# EAGLE design mult (EAGLE 6.6.0)
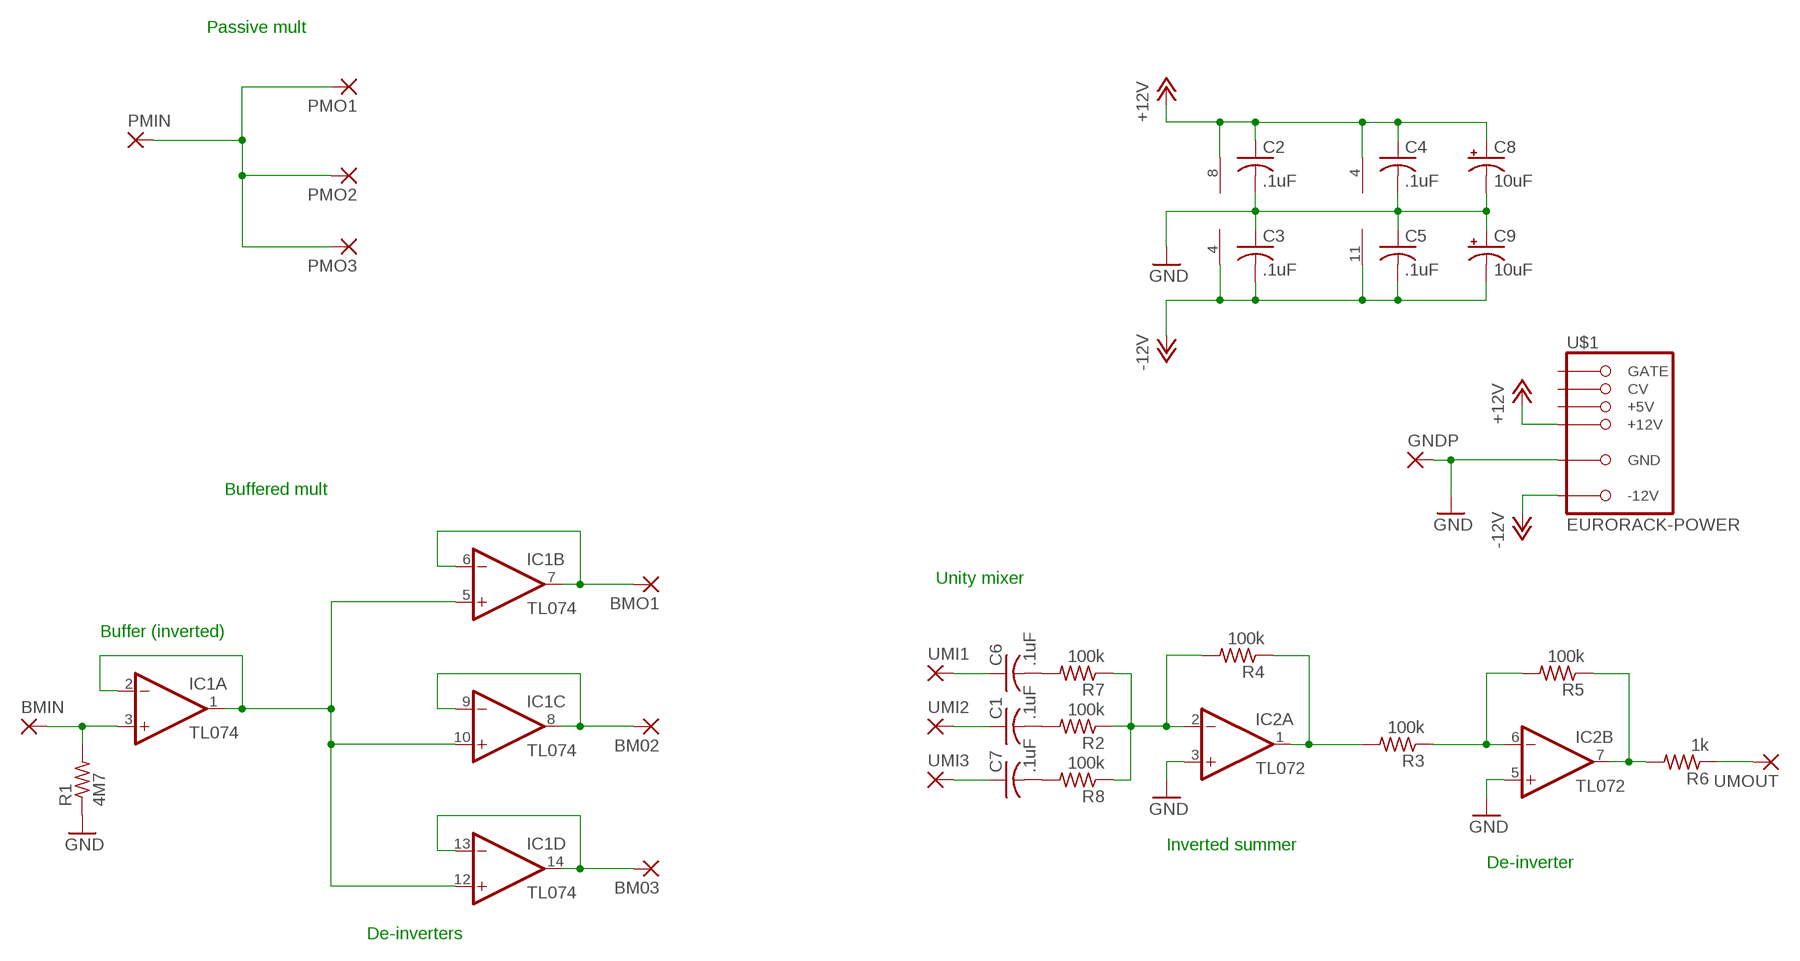
[diagram p0: schematic, sheet 1]

## Parts
BM02  2,54/1,0  [2,54/1,0]
BM03  2,54/1,0  [2,54/1,0]
BMIN  2,54/1,0  [2,54/1,0]
BMO1  2,54/1,0  [2,54/1,0]
C1  .1uF  C-US050-025X075  [C050-025X075]
C2  .1uF  C-US050-025X075  [C050-025X075]
C3  .1uF  C-US050-025X075  [C050-025X075]
C4  .1uF  C-US050-025X075  [C050-025X075]
C5  .1uF  C-US050-025X075  [C050-025X075]
C6  .1uF  C-US050-025X075  [C050-025X075]
C7  .1uF  C-US050-025X075  [C050-025X075]
C8  10uF  CPOL-USE2.5-5  [E2,5-5]
C9  10uF  CPOL-USE2.5-5  [E2,5-5]
GNDP  2,54/1,0  [2,54/1,0]
IC1  TL074  TL074-TOPP  [DIL14]
IC2  TL072  TL072-TOPP  [DIL08]
PMIN  2,54/1,0  [2,54/1,0]
PMO1  2,54/1,0  [2,54/1,0]
PMO2  2,54/1,0  [2,54/1,0]
PMO3  2,54/1,0  [2,54/1,0]
R1  4M7  R-US_0207/10  [0207/10]
R2  100k  R-US_0207/10  [0207/10]
R3  100k  R-US_0207/10  [0207/10]
R4  100k  R-US_0207/10  [0207/10]
R5  100k  R-US_0207/10  [0207/10]
R6  1k  R-US_0207/10  [0207/10]
R7  100k  R-US_0207/10  [0207/10]
R8  100k  R-US_0207/10  [0207/10]
U$1  EURORACK-POWER  [PINSHRD_PTH_2X8]
UMI1  2,54/1,0  [2,54/1,0]
UMI2  2,54/1,0  [2,54/1,0]
UMI3  2,54/1,0  [2,54/1,0]
UMOUT  2,54/1,0  [2,54/1,0]

## Nets
+12V: C2.1 C4.1 C8.+ IC1.4(P:V+) IC2.8(P:V+) U$1.+12V@1(+12V) U$1.+12V@2(+12V)
-12V: C3.2 C5.2 C9.- IC1.11(P:V-) IC2.4(P:V-) U$1.-12V@1(-12V) U$1.-12V@2(-12V)
GND: C2.2 C3.1 C4.2 C5.1 C8.- C9.+ GNDP.1(P) IC2.3(A:+IN) IC2.5(B:+IN) R1.1 U$1.GND@1(GND) U$1.GND@2(GND) U$1.GND@3(GND) U$1.GND@4(GND) U$1.GND@5(GND) U$1.GND@6(GND)
N$1: IC2.7(B:OUT) R5.1 R6.2
N$2: IC2.2(A:-IN) R2.1 R4.2 R7.1 R8.1
N$3: IC2.1(A:OUT) R3.2 R4.1
N$4: IC2.6(B:-IN) R3.1 R5.2
N$5: C1.2 R2.2
N$6: R6.1 UMOUT.1(P)
N$7: C6.1 UMI1.1(P)
N$8: C6.2 R7.2
N$9: C1.1 UMI2.1(P)
N$10: C7.2 R8.2
N$11: C7.1 UMI3.1(P)
N$12: BMIN.1(P) IC1.3(A:+IN) R1.2
N$13: IC1.1(A:OUT) IC1.2(A:-IN) IC1.5(B:+IN) IC1.10(C:+IN) IC1.12(D:+IN)
N$16: BM03.1(P) IC1.13(D:-IN) IC1.14(D:OUT)
N$17: BM02.1(P) IC1.8(C:OUT) IC1.9(C:-IN)
N$18: BMO1.1(P) IC1.6(B:-IN) IC1.7(B:OUT)
PMULT: PMIN.1(P) PMO1.1(P) PMO2.1(P) PMO3.1(P)
Unconnected: U$1.+5V@1(+5V) U$1.+5V@2(+5V) U$1.CV@1(CV) U$1.CV@2(CV) U$1.GATE@1(GATE) U$1.GATE@2(GATE)

## Notes on the sheet
- Passive mult
- Buffered mult
- Unity mixer
- Buffer (inverted)
- Inverted summer
- De-inverter
- De-inverters

## Library data of the parts
BM02 BM03 BMIN BMO1 GNDP PMIN PMO1-PMO3 UMI1-UMI3 UMOUT = wirepad:2,54/1,0: THROUGH-HOLE PAD
C1-C7 = rcl:C-US: CAPACITOR, American symbol
C8 C9 = rcl:CPOL-US: POLARIZED CAPACITOR, American symbol
IC1 = mmoretti:TL074-TOP: OP AMP
IC2 = mmoretti:TL072-TOP: OP AMP
R1-R8 = rcl:R-US_: RESISTOR, American symbol
U$1 = mmoretti:EURORACK-POWER

## Board
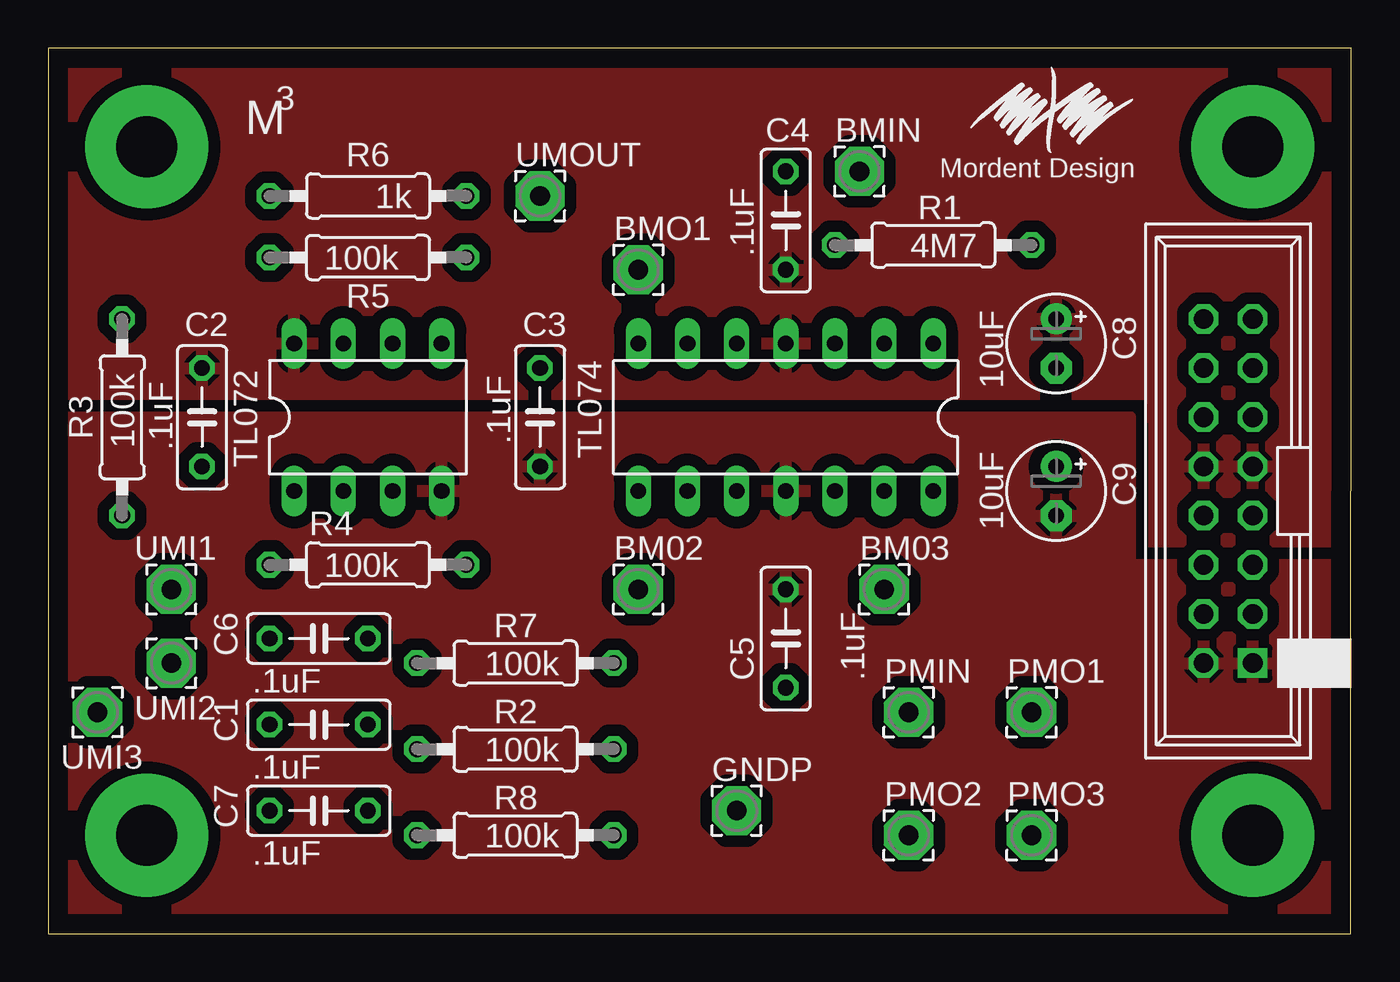
[diagram p1: board, top side]
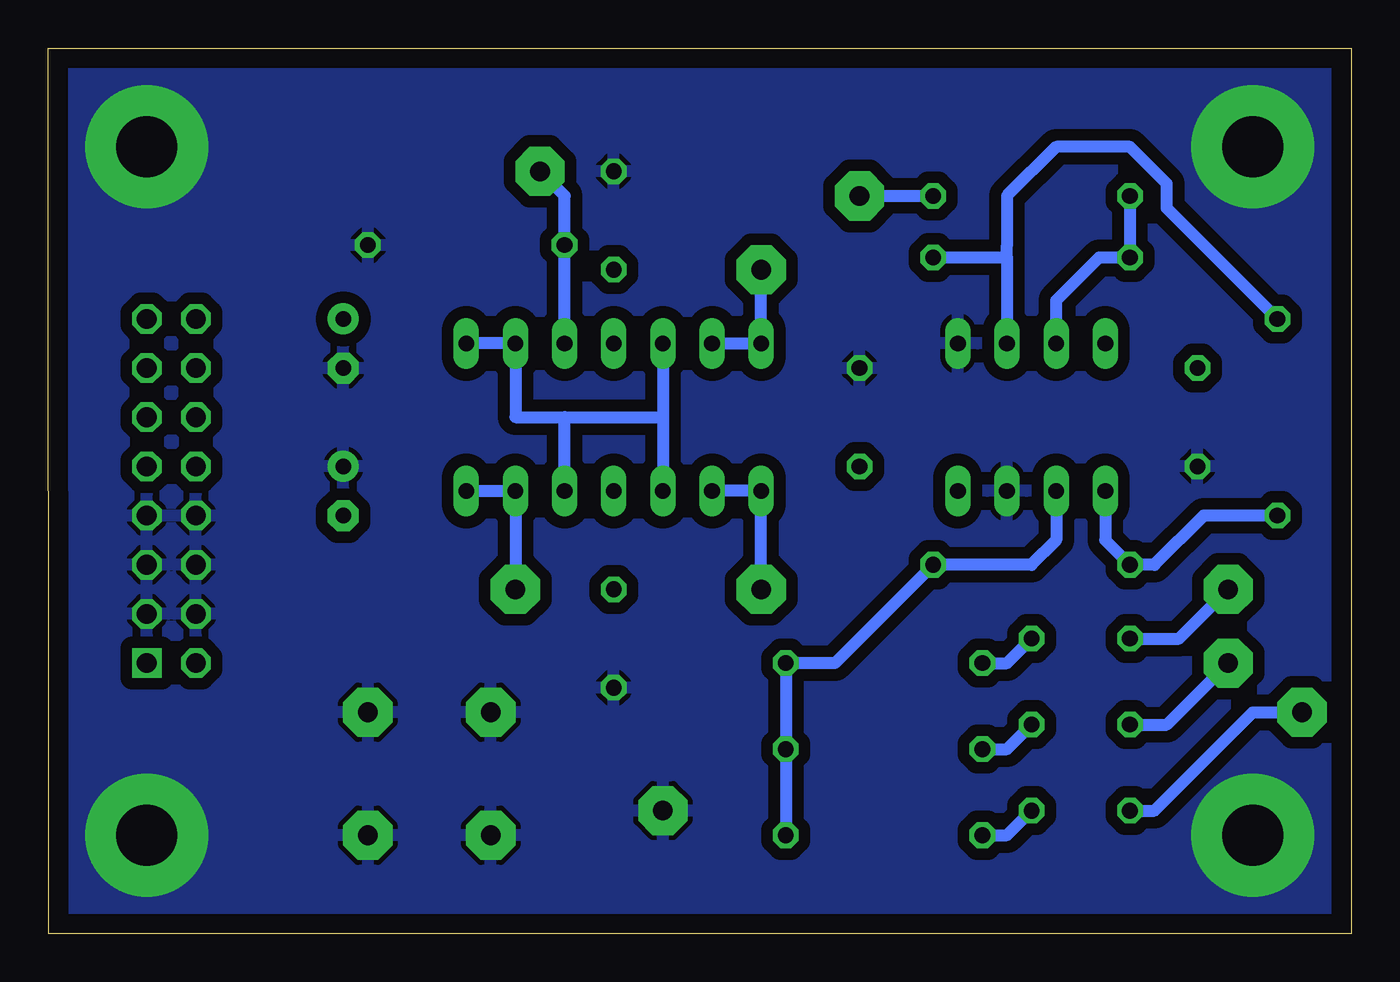
[diagram p2: board, bottom side, seen from below]

Size 67.31 x 45.72 mm. Coordinates in mm from the lower left corner, seen from the top.
Outline: 0,0 67.29,0 67.31,45.72 0,45.72 0,0
Copper layers (1*16): Top 0.035mm / dielectric 1.5mm / Bottom 0.035mm
Design rules "default": minimum track width 10mil, minimum drill 24mil, track to track 8mil, track to pad 8mil, pad to pad 8mil, via to via 8mil, smd to smd 8mil, copper to edge 40mil, drill to drill 8mil, minimum pad ring 10mil, minimum via ring 8mil, stop-mask expansion 4mil, vias tented up to drill 0mil, thermal gap 10mil

### Footprints (pad centres in the part's own frame; a part is rotated, then mirrored left to right if it is on the bottom)
2,54/1,0 = drill 1.016 pad 2.54 octagon: 1 0,0
C050-025X075 = drill 0.813 octagon: 1 -2.54,0; 2 2.54,0
E2,5-5 = drill 0.813 pad 1.6: + -1.27,0 | drill 0.813 pad 1.6 octagon: - 1.27,0
DIL14 = drill 0.813 long: 1 -7.62,-3.81; 2 -5.08,-3.81; 3 -2.54,-3.81; 4 0,-3.81; 5 2.54,-3.81; 6 5.08,-3.81; 7 7.62,-3.81; 8 7.62,3.81; 9 5.08,3.81; 10 2.54,3.81; 11 0,3.81; 12 -2.54,3.81; 13 -5.08,3.81; 14 -7.62,3.81
DIL08 = drill 0.813 long: 1 -3.81,-3.81; 2 -1.27,-3.81; 3 1.27,-3.81; 4 3.81,-3.81; 5 3.81,3.81; 6 1.27,3.81; 7 -1.27,3.81; 8 -3.81,3.81
0207/10 = drill 0.813 octagon: 1 -5.08,0; 2 5.08,0
PINSHRD_PTH_2X8 = drill 1.016 octagon: +5V@1 3.81,1.27; +5V@2 3.81,-1.27; +12V@1 1.27,1.27; +12V@2 1.27,-1.27; -12V@1 -8.89,1.27; CV@1 6.35,1.27; CV@2 6.35,-1.27; GATE@1 8.89,1.27; GATE@2 8.89,-1.27; GND@1 -6.35,1.27; GND@2 -6.35,-1.27; GND@3 -3.81,1.27; GND@4 -3.81,-1.27; GND@5 -1.27,1.27; GND@6 -1.27,-1.27 | drill 1.016 square: -12V@2 -8.89,-1.27

### Placement (x,y rotation side)
BM02  30.48,17.78 0 top
BM03  43.18,17.78 0 top
BMIN  41.91,39.37 0 top
BMO1  30.48,34.29 0 top
C1  13.97,10.79 0 top
C2  7.94,26.67 270 top
C3  25.4,26.67 270 top
C4  38.1,36.83 90 top
C5  38.1,15.24 90 top
C6  13.97,15.24 0 top
C7  13.97,6.35 0 top
C8  52.07,30.48 270 top
C9  52.07,22.86 270 top
GNDP  35.56,6.35 0 top
IC1  38.1,26.67 180 top
IC2  16.51,26.67 0 top
PMIN  44.45,11.43 0 top
PMO1  50.8,11.43 0 top
PMO2  44.45,5.08 0 top
PMO3  50.8,5.08 0 top
R1  45.72,35.56 180 top
R2  24.13,9.53 180 top
R3  3.81,26.67 270 top
R4  16.51,19.05 0 top
R5  16.51,34.92 0 top
R6  16.51,38.1 180 top
R7  24.13,13.97 180 top
R8  24.13,5.08 180 top
U$1  60.96,22.86 90 top
UMI1  6.35,17.78 270 top
UMI2  6.35,13.97 270 top
UMI3  2.54,11.43 270 top
UMOUT  25.4,38.1 0 top

### Tracks (layer width: path | path; a pad name or v marks a point on that pad's centre or on a via)
+12V
  pour Top (isolate 0.61, rank 2): 0,45.72 67.31,45.72 67.31,19.05 57.15,19.05 57.15,26.67 0,26.67
-12V
  pour Top (isolate 0.61): 67.31,0 0,0 0,26.67 55.88,26.67 55.88,19.05 67.31,19.05
GND  (via drill 3.17 pad 6.35)
  other vias: 5.08,40.64 5.08,5.08 62.23,5.08 62.23,40.64
  pour Bottom (isolate 0.61): 0,45.72 67.31,45.72 67.31,0 0,0
N$1
  Bottom 0.61: R6.2 R5.1 13.02,34.92 15.24,32.7 IC2.7
N$2
  Bottom 0.61: IC2.2 15.24,20.32 16.51,19.05 R4.2 26.67,13.97 R7.1 R2.1 R8.1
N$3
  Bottom 0.61: R3.2 7.62,21.59 10.16,19.05 R4.1 12.7,20.32 IC2.1
N$4
  Bottom 0.61: R3.1 9.53,37.47 9.53,38.73 11.43,40.64 15.24,40.64 17.78,38.1 17.78,35.56 17.78,34.92 | 17.78,34.92 IC2.6 | R5.2 17.78,34.92
N$5
  Bottom 0.61: R2.2 17.78,9.53 C1.2
N$6
  Bottom 0.61: UMOUT.1 R6.1
N$7
  Bottom 0.61: C6.1 8.89,15.24 UMI1.1
N$8
  Bottom 0.61: R7.2 17.78,13.97 C6.2
N$9
  Bottom 0.61: C1.1 9.53,10.79 UMI2.1
N$10
  Bottom 0.61: R8.2 17.78,5.08 C7.2
N$11
  Bottom 0.61: C7.1 10.16,6.35 5.08,11.43 UMI3.1
N$12
  Bottom 0.61: IC1.3 R1.2 40.64,38.1 BMIN.1
N$13
  Bottom 0.61: IC1.5 35.56,26.67 | 35.56,26.67 IC1.10 | IC1.1 IC1.2 43.18,26.67 40.64,26.67 | 40.64,26.67 35.56,26.67 | IC1.12 40.64,26.67
N$16
  Bottom 0.61: IC1.14 IC1.13 BM03.1
N$17
  Bottom 0.61: BM02.1 IC1.8 IC1.9
N$18
  Bottom 0.61: IC1.6 IC1.7 BMO1.1
PMULT
  pour Bottom (isolate 0.61): 41.91,13.97 53.34,13.97 53.34,2.54 41.91,2.54

### Text on the board
tPlace: 3 | M | Mordent Design